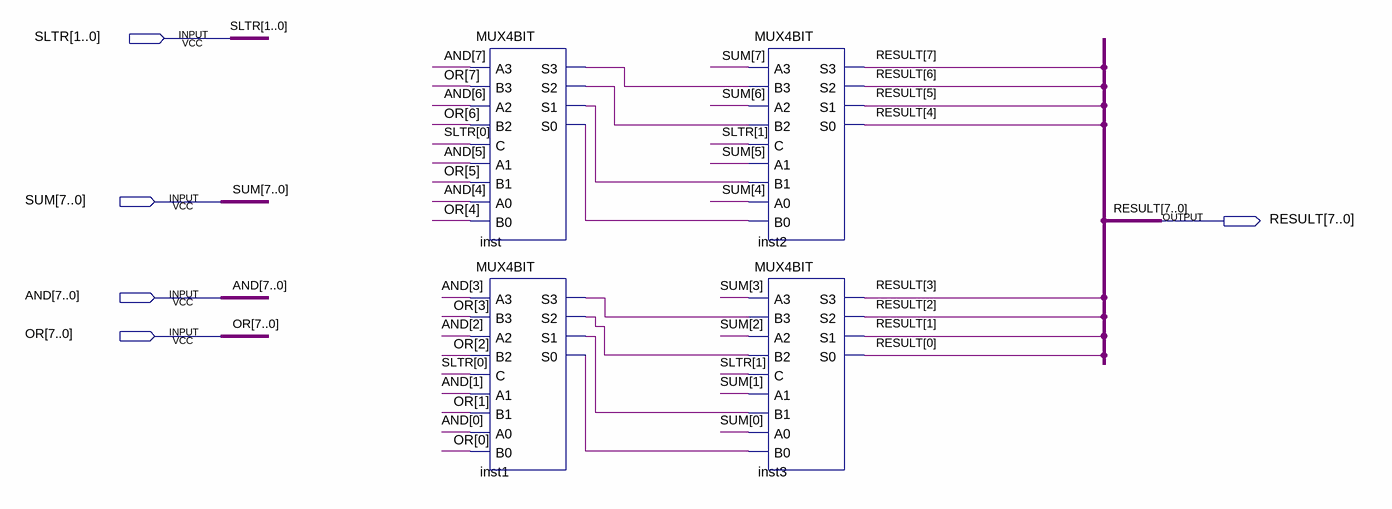
[diagram p0: schematic sheet]
// Quartus schematic MEGAMUXFODASTICO.bdf as structural Verilog: 4 symbols, 5 pins
module MEGAMUXFODASTICO (
  input  [1:0] SLTR,
  input  [7:0] SUM,
  input  [7:0] AND,
  input  [7:0] OR,
  output [7:0] RESULT
);

  wire inst1_s0, inst1_s1, inst1_s2, inst1_s3, inst_s0, inst_s1, inst_s2, inst_s3;

  MUX4BIT inst (
    .A3(AND[7]), .B3(OR[7]), .A2(AND[6]), .B2(OR[6]), .C(SLTR[0]), .A1(AND[5]), .B1(OR[5]), .A0(AND[4]),
    .B0(OR[4]), .S3(inst_s3), .S2(inst_s2), .S1(inst_s1), .S0(inst_s0));
  MUX4BIT inst1 (
    .A3(AND[3]), .B3(OR[3]), .A2(AND[2]), .B2(OR[2]), .C(SLTR[0]), .A1(AND[1]), .B1(OR[1]), .A0(AND[0]),
    .B0(OR[0]), .S3(inst1_s3), .S2(inst1_s2), .S1(inst1_s1), .S0(inst1_s0));
  MUX4BIT inst2 (
    .A3(SUM[7]), .B3(inst_s3), .A2(SUM[6]), .B2(inst_s2), .C(SLTR[1]), .A1(SUM[5]), .B1(inst_s1),
    .A0(SUM[4]), .B0(inst_s0), .S3(RESULT[7]), .S2(RESULT[6]), .S1(RESULT[5]), .S0(RESULT[4]));
  MUX4BIT inst3 (
    .A3(SUM[3]), .B3(inst1_s3), .A2(SUM[2]), .B2(inst1_s2), .C(SLTR[1]), .A1(SUM[1]), .B1(inst1_s1),
    .A0(SUM[0]), .B0(inst1_s0), .S3(RESULT[3]), .S2(RESULT[2]), .S1(RESULT[1]), .S0(RESULT[0]));
endmodule
